# Altium schematic sheet Voltage supply of sEMG & ADC.SchDoc
size 297 x 209 mm
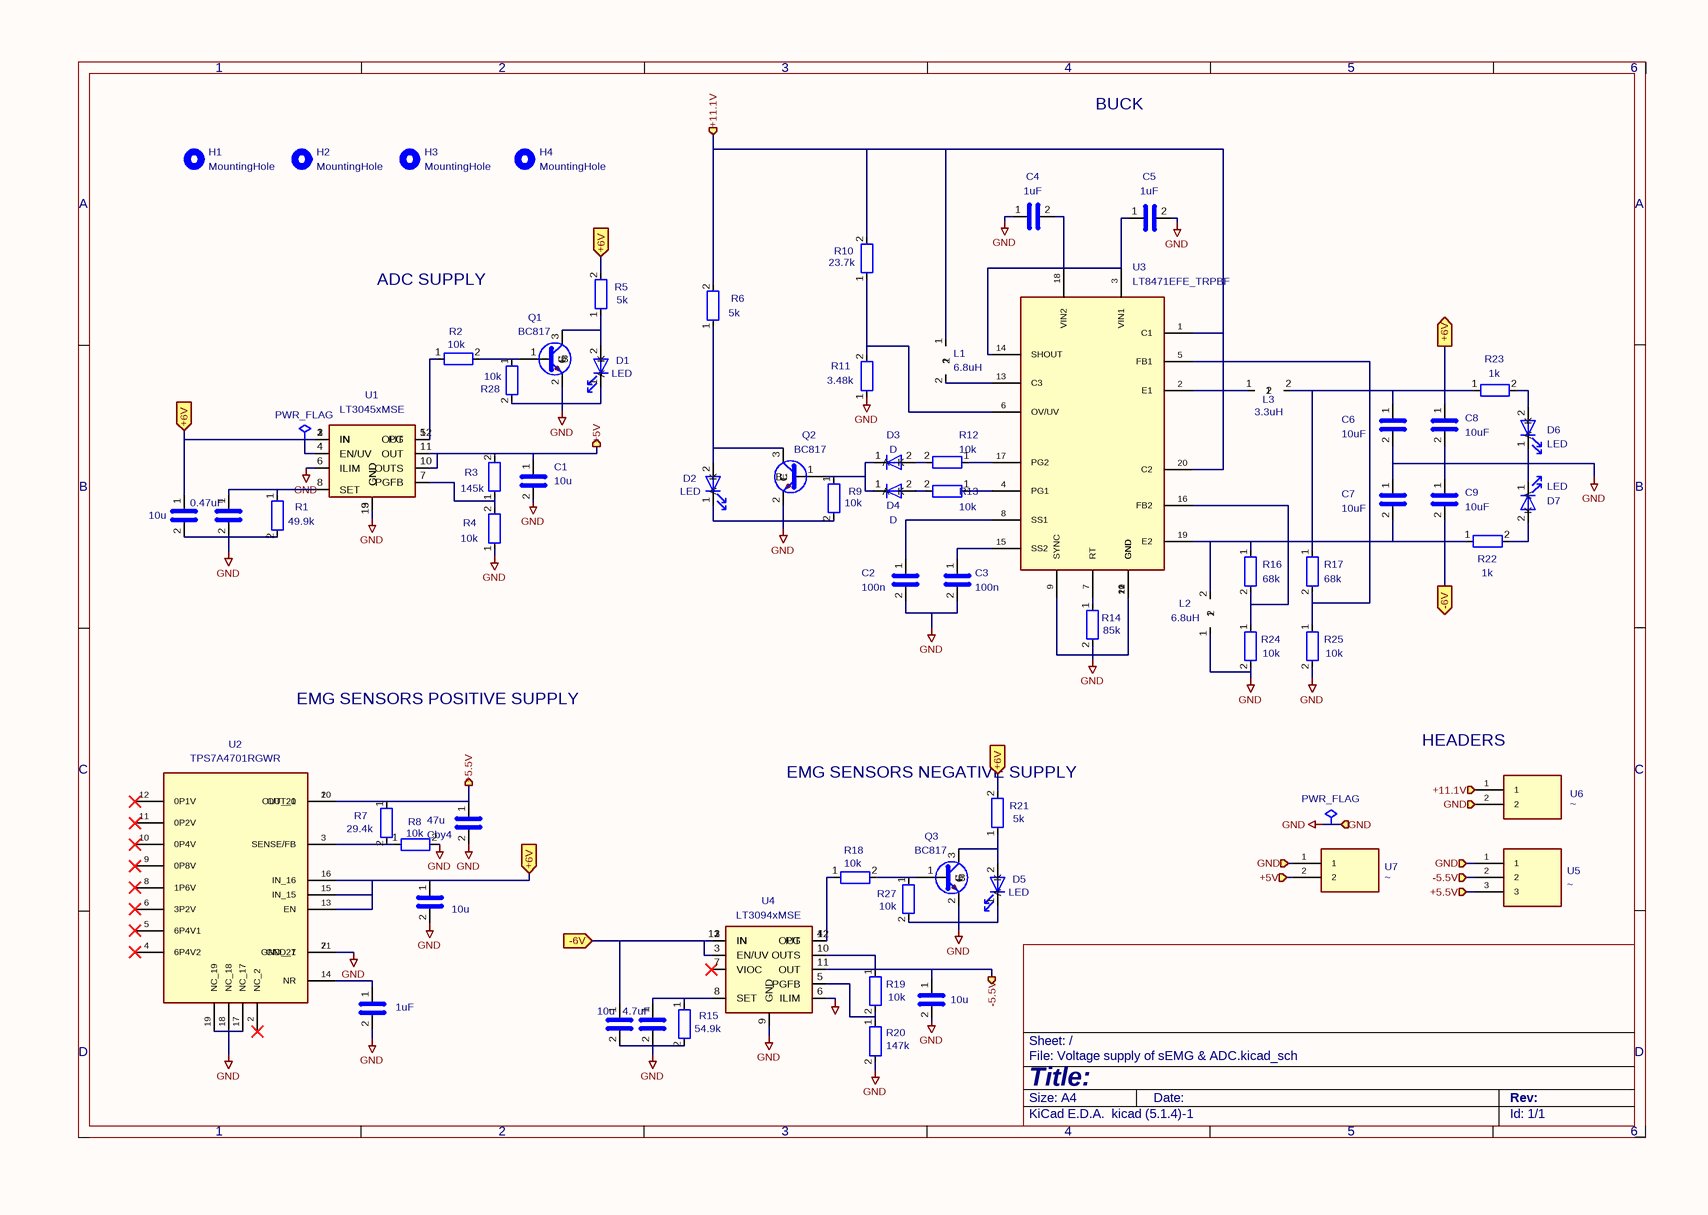
[diagram p0: Voltage supply of sEMG & ADC.SchDoc]

## Parts
#FLG01  PWR_FLAG  (graphical)
#FLG02  PWR_FLAG  (graphical)
C1  10u  [C_0805_2012Metric_Pad1.18x1.45mm_HandSolder]
C2  100n  [C_0402_1005Metric_Pad0.74x0.62mm_HandSolder]
C2in1  1uF  [C_0402_1005Metric_Pad0.74x0.62mm_HandSolder]
C3  100n  [C_0402_1005Metric_Pad0.74x0.62mm_HandSolder]
C4  1uF  [C_0603_1608Metric_Pad1.08x0.95mm_HandSolder]
C5  1uF  [C_0603_1608Metric_Pad1.08x0.95mm_HandSolder]
C6  10uF  [C_0805_2012Metric_Pad1.18x1.45mm_HandSolder]
C7  10uF  [C_0805_2012Metric_Pad1.18x1.45mm_HandSolder]
C8  10uF  [C_0805_2012Metric_Pad1.18x1.45mm_HandSolder]
C9  10uF  [C_0805_2012Metric_Pad1.18x1.45mm_HandSolder]
Cby1  10u  [C_0805_2012Metric_Pad1.18x1.45mm_HandSolder]
Cby2  0.47uF  [C_0805_2012Metric_Pad1.18x1.45mm_HandSolder]
Cby3  10u  [C_0805_2012Metric_Pad1.18x1.45mm_HandSolder]
Cby4  47u  [C_1210_3225Metric_Pad1.33x2.70mm_HandSolder]
Cby5  10u  [C_0805_2012Metric_Pad1.18x1.45mm_HandSolder]
Cby6  4.7uF  [C_0805_2012Metric_Pad1.18x1.45mm_HandSolder]
Cby7  10u  [C_0805_2012Metric_Pad1.18x1.45mm_HandSolder]
D1  LED  [LED_0603_1608Metric_Pad1.05x0.95mm_HandSolder]
D2  LED  [LED_0603_1608Metric_Pad1.05x0.95mm_HandSolder]
D3  D  [D_SOD-123]
D4  D  [D_SOD-123]
D5  LED  [LED_0603_1608Metric_Pad1.05x0.95mm_HandSolder]
D6  LED  [LED_0603_1608Metric_Pad1.05x0.95mm_HandSolder]
D7  LED  [LED_0603_1608Metric_Pad1.05x0.95mm_HandSolder]
H1  MountingHole  [MountingHole_2.7mm_M2.5_DIN965]
H2  MountingHole  [MountingHole_2.7mm_M2.5_DIN965]
H3  MountingHole  [MountingHole_2.7mm_M2.5_DIN965]
H4  MountingHole  [MountingHole_2.7mm_M2.5_DIN965]
L1  6.8uH  [L_Coilcraft_XAL7030-102]
L2  6.8uH  [L_Coilcraft_XAL7030-102]
L3  3.3uH  [L_Coilcraft_XAL5030-XXX]
Q1  BC817  [SOT-23]
Q2  BC817  [SOT-23]
Q3  BC817  [SOT-23]
R1  49.9k  [R_0603_1608Metric_Pad0.98x0.95mm_HandSolder]
R2  10k  [R_0402_1005Metric_Pad0.72x0.64mm_HandSolder]
R3  145k  [R_0603_1608Metric_Pad0.98x0.95mm_HandSolder]
R4  10k  [R_0402_1005Metric_Pad0.72x0.64mm_HandSolder]
R5  5k  [R_0603_1608Metric_Pad0.98x0.95mm_HandSolder]
R6  5k  [R_0603_1608Metric_Pad0.98x0.95mm_HandSolder]
R7  29.4k  [R_0402_1005Metric_Pad0.72x0.64mm_HandSolder]
R8  10k  [R_0402_1005Metric_Pad0.72x0.64mm_HandSolder]
R9  10k  [R_0402_1005Metric_Pad0.72x0.64mm_HandSolder]
R10  23.7k  [R_0402_1005Metric_Pad0.72x0.64mm_HandSolder]
R11  3.48k  [R_0603_1608Metric_Pad0.98x0.95mm_HandSolder]
R12  10k  [R_0402_1005Metric_Pad0.72x0.64mm_HandSolder]
R13  10k  [R_0402_1005Metric_Pad0.72x0.64mm_HandSolder]
R14  85k  [R_0603_1608Metric_Pad0.98x0.95mm_HandSolder]
R15  54.9k  [R_0603_1608Metric_Pad0.98x0.95mm_HandSolder]
R16  68k  [R_0603_1608Metric_Pad0.98x0.95mm_HandSolder]
R17  68k  [R_0603_1608Metric_Pad0.98x0.95mm_HandSolder]
R18  10k  [R_0402_1005Metric_Pad0.72x0.64mm_HandSolder]
R19  10k  [R_0402_1005Metric_Pad0.72x0.64mm_HandSolder]
R20  147k  [R_0603_1608Metric_Pad0.98x0.95mm_HandSolder]
R21  5k  [R_0603_1608Metric_Pad0.98x0.95mm_HandSolder]
R22  1k  [R_0603_1608Metric_Pad0.98x0.95mm_HandSolder]
R23  1k  [R_0603_1608Metric_Pad0.98x0.95mm_HandSolder]
R24  10k  [R_0603_1608Metric_Pad0.98x0.95mm_HandSolder]
R25  10k  [R_0603_1608Metric_Pad0.98x0.95mm_HandSolder]
R27  10k  [R_0603_1608Metric_Pad0.98x0.95mm_HandSolder]
R28  10k  [R_0603_1608Metric_Pad0.98x0.95mm_HandSolder]
U1  LT3045xMSE  [MSOP-12-1EP_3x4.039mm_P0.65mm_EP1.651x2.845mm]
U2  TPS7A4701RGWR  [QFN65P500X500X100-21N]
U3  LT8471EFE_TRPBF  [SOP65P640X120-21N]
U4  LT3094xMSE  [MSOP-12-1EP_3x4.039mm_P0.65mm_EP1.651x2.845mm]
U5  ~  [JST_GH_SM03B-GHS-TB_1x03-1MP_P1.25mm_Horizontal]
U6  ~  [JST_GH_SM02B-GHS-TB_1x02-1MP_P1.25mm_Horizontal]
U7  ~  [JST_GH_SM02B-GHS-TB_1x02-1MP_P1.25mm_Horizontal]

## Ports
+5.5V (in), +5.5V (out), +5V (in), +5V (out), +6V (in), +6V (out), +11.1V (in), +11.1V (out), -5.5V (in), -5.5V (out), -6V (in), -6V (out), GND (in), GND (out)

## Nets
GND: #FLG01.1 C1.2 C2.2 C2in1.2 C3.2 C4.1 C5.2 C6.2 C7.1 C8.2 C9.1 Cby1.2 Cby2.2 Cby3.2 Cby4.2 Cby5.2 Cby6.2 Cby7.2 D1.1(K) D2.1(K) D5.1(K) D6.1(K) D7.1(K) L2.1 Q1.2(E) Q2.2(E) Q3.2(E) R1.2 R4.1 R8.2 R9.2 R11.1 R14.2 R15.2 R20.2 R24.2 R25.2 R27.2 R28.2 U1.6(ILIM) U1.9(GND) U1.13(GND) U2.7(GND_7) U2.17(NC_17) U2.18(NC_18) U2.19(NC_19) U2.21(GND_21) U3.9(SYNC) U3.10(GND) U3.11(GND) U3.12(GND) U3.21(GND) U4.6(ILIM) U4.9(GND) U5.1 U6.2 U7.1 ; port GND
+5.5V: Cby4.1 R7.1 U2.1(OUT_1) U2.20(OUT_20) U5.3 ; port +5.5V
+5V: C1.1 R3.2 U1.10(OUTS) U1.11(OUT) U7.2 ; port +5V
+6V: #FLG02.1 C6.1 C8.1 Cby1.1 Cby3.1 L3.2 R5.2 R17.1 R21.2 R23.1 U1.1(IN) U1.2(IN) U1.3(IN) U1.4(EN/UV) U2.13(EN) U2.15(IN_15) U2.16(IN_16) ; port +6V
+11.1V: L1.1 R6.2 R10.2 U3.1(C1) U3.20(C2) U6.1 ; port +11.1V
-5.5V: Cby7.1 R19.1 U4.10(OUTS) U4.11(OUT) U5.2 ; port -5.5V
-6V: C7.2 C9.2 Cby5.1 L2.2 R16.1 R22.1 U3.19(E2) U4.1(IN) U4.2(IN) U4.3(EN/UV) U4.13(IN) ; port -6V
NetC2_1: C2.1 U3.8(SS1)
NetC2in1_1: C2in1.1 U2.14(NR)
NetC3_1: C3.1 U3.15(SS2)
NetC4_2: C4.2 C5.1 U3.3(VIN1) U3.14(SHOUT) U3.18(VIN2)
NetCby2_1: Cby2.1 R1.1 U1.8(SET)
NetCby6_1: Cby6.1 R15.1 U4.8(SET)
NetD1_2: D1.2(A) Q1.3(C) R5.1
NetD2_2: D2.2(A) Q2.3(C) R6.1
NetD3_1: D3.1(K) D4.1(K) Q2.1(B) R9.1
NetD3_2: D3.2(A) R12.2
NetD4_2: D4.2(A) R13.2
NetD5_2: D5.2(A) Q3.3(C) R21.1
NetD6_2: D6.2(A) R23.2
NetD7_2: D7.2(A) R22.2
NetL1_2: L1.2 U3.13(C3)
NetL3_1: L3.1 U3.2(E1)
NetQ1_1: Q1.1(B) R2.2 R28.1
NetQ3_1: Q3.1(B) R18.2 R27.1
NetR2_1: R2.1 U1.5(PG) U1.12(OUT)
NetR3_1: R3.1 R4.2 U1.7(PGFB)
NetR7_2: R7.2 R8.1 U2.3(SENSE/FB)
NetR10_1: R10.1 R11.2 U3.6(OV/UV)
NetR12_1: R12.1 U3.17(PG2)
NetR13_1: R13.1 U3.4(PG1)
NetR14_1: R14.1 U3.7(RT)
NetR16_2: R16.2 R24.1 U3.16(FB2)
NetR17_2: R17.2 R25.1 U3.5(FB1)
NetR18_1: R18.1 U4.4(PG) U4.12(OUT)
NetR19_2: R19.2 R20.1 U4.5(PGFB)

Not connected (* = marked no-connect by the designer): U2 2(NC_2)* 4(6P4V2)* 5(6P4V1)* 6(3P2V)* 8(1P6V)* 9(0P8V)* 10(0P4V)* 11(0P2V)* 12(0P1V)*; U4 7(VIOC)*

## Notes on the sheet
- BUCK
- ADC SUPPLY
- EMG SENSORS POSITIVE SUPPLY
- (near R21) EMG SENSORS NEGATIVE SUPPLY
- (near U6) HEADERS
- 1
- 2
- 3
- 4
- 5
- 6
- A
- B
- C
- D
- Title:
- File: Voltage supply of sEMG & ADC.kicad_sch
- Sheet: /
- KiCad E.D.A.  kicad (5.1.4)-1
- Size: A4
- Date:
- Rev:
- Id: 1/1

## Library data of the parts
#FLG01 #FLG02 = PWR_FLAG: Description: Special symbol for telling ERC where power comes from; Value: PWR_FLAG
C1 C2 C2in1 C3-C9 Cby1-Cby7 = C: Description: Unpolarized capacitor
  C1 Cby1 Cby3 Cby5 Cby7: Value: 10u; Footprint: Capacitor_SMD:C_0805_2012Metric_Pad1.18x1.45mm_HandSolder
  C2 C3: Value: 100n; Footprint: Capacitor_SMD:C_0402_1005Metric_Pad0.74x0.62mm_HandSolder
  C2in1: Value: 1uF; Footprint: Capacitor_SMD:C_0402_1005Metric_Pad0.74x0.62mm_HandSolder
  C4 C5: Value: 1uF; Footprint: Capacitor_SMD:C_0603_1608Metric_Pad1.08x0.95mm_HandSolder
  C6-C9: Value: 10uF; Footprint: Capacitor_SMD:C_0805_2012Metric_Pad1.18x1.45mm_HandSolder
  Cby2: Value: 0.47uF; Footprint: Capacitor_SMD:C_0805_2012Metric_Pad1.18x1.45mm_HandSolder
  Cby4: Value: 47u; Footprint: Capacitor_SMD:C_1210_3225Metric_Pad1.33x2.70mm_HandSolder
  Cby6: Value: 4.7uF; Footprint: Capacitor_SMD:C_0805_2012Metric_Pad1.18x1.45mm_HandSolder
D1 D2 D5-D7 = LED: Description: Light emitting diode; Value: LED; Footprint: LED_SMD:LED_0603_1608Metric_Pad1.05x0.95mm_HandSolder
D3 D4 = D: Description: Diode; Sim.Pins: 1=K 2=A; Sim.Device: D; Value: D; Footprint: Diode_SMD:D_SOD-123
H1-H4 = MountingHole: Description: Mounting Hole without connection; Value: MountingHole; Footprint: MountingHole:MountingHole_2.7mm_M2.5_DIN965
L1-L3 = L: Description: Inductor
  L1: Website: https://www.digikey.com/en/products/detail/coilcraft/LPS4018-682MRC/12714582; Value: 6.8uH; Footprint: Inductor_SMD:L_Coilcraft_XAL7030-102
  L2: Website: https://www.digikey.com/en/products/detail/w%C3%BCrth-elektronik/74437324068/2791049; Value: 6.8uH; Footprint: Inductor_SMD:L_Coilcraft_XAL7030-102
  L3: Website: https://www.digikey.com/en/products/detail/w%C3%BCrth-elektronik/74437324033/2791046; Value: 3.3uH; Footprint: Inductor_SMD:L_Coilcraft_XAL5030-XXX
Q1-Q3 = BC817: Description: 0.8A Ic, 45V Vce, NPN Transistor, SOT-23; Value: BC817; Footprint: Package_TO_SOT_SMD:SOT-23
R1-R25 R27 R28 = R: Description: Resistor
  R1: Value: 49.9k; Footprint: Resistor_SMD:R_0603_1608Metric_Pad0.98x0.95mm_HandSolder
  R2 R4 R8 R9 R12 R13 R18 R19: Value: 10k; Footprint: Resistor_SMD:R_0402_1005Metric_Pad0.72x0.64mm_HandSolder
  R3: Value: 145k; Footprint: Resistor_SMD:R_0603_1608Metric_Pad0.98x0.95mm_HandSolder
  R5 R6 R21: Value: 5k; Footprint: Resistor_SMD:R_0603_1608Metric_Pad0.98x0.95mm_HandSolder
  R7: Value: 29.4k; Footprint: Resistor_SMD:R_0402_1005Metric_Pad0.72x0.64mm_HandSolder
  R10: Website: https://www.digikey.be/en/products/detail/stackpole-electronics-inc/RMCF0402FT23K7/1714563; Value: 23.7k; Footprint: Resistor_SMD:R_0402_1005Metric_Pad0.72x0.64mm_HandSolder
  R11: Website: https://www.digikey.in/en/products/detail/yageo/RC0402FR-073K48L/5281008; Value: 3.48k; Footprint: Resistor_SMD:R_0603_1608Metric_Pad0.98x0.95mm_HandSolder
  R14: Value: 85k; Footprint: Resistor_SMD:R_0603_1608Metric_Pad0.98x0.95mm_HandSolder
  R15: Value: 54.9k; Footprint: Resistor_SMD:R_0603_1608Metric_Pad0.98x0.95mm_HandSolder
  R16 R17: Website: https://www.digikey.com/en/products/detail/susumu/RG1608P-683-B-T5/1228890; Value: 68k; Footprint: Resistor_SMD:R_0603_1608Metric_Pad0.98x0.95mm_HandSolder
  R20: Value: 147k; Footprint: Resistor_SMD:R_0603_1608Metric_Pad0.98x0.95mm_HandSolder
  R22 R23: Value: 1k; Footprint: Resistor_SMD:R_0603_1608Metric_Pad0.98x0.95mm_HandSolder
  R24 R25 R27 R28: Website: https://www.digikey.lv/en/products/detail/panasonic-electronic-components/ERA-3AEB103V/1465878; Value: 10k; Footprint: Resistor_SMD:R_0603_1608Metric_Pad0.98x0.95mm_HandSolder
U1 = LT3045xMSE: Description: 500mA, Adjustable, Ultralow Noise, Ultrahigh PSRR Linear Regulator, MSOP-12; Value: LT3045xMSE; Footprint: Package_SO:MSOP-12-1EP_3x4.039mm_P0.65mm_EP1.651x2.845mm
U3 = LT8471EFE_TRPBF: MF: Analog Devices; MP: LT8471EFE#TRPBF; Description_1: \n                        \n                            Dual Multitopology DC/DC Converters with 2A Switches and Synchronization\n                        \n; MAXIMUM_PACKAGE_HEIGHT: 1.2 mm; Package: TSSOP -20 Analog Devices; Price: None; Check_prices: https://www.snapeda.com/parts/LT8471EFE%23TRPBF/Analog+Devices/view-part/?ref=eda; STANDARD: IPC-7351B; PARTREV: D; SnapEDA_Link: https://www.snapeda.com/parts/LT8471EFE%23TRPBF/Analog+Devices/view-part/?ref=snap; Availability: In Stock; MANUFACTURER: Analog Devices; Value: LT8471EFE_TRPBF; Footprint: BUCK:SOP65P640X120-21N
U4 = LT3094xMSE: Description: -500mA, Adjustable, Ultralow Noise, Ultrahigh PSRR RF Negative Linear Regulator, MSOP-12; Value: LT3094xMSE; Footprint: Package_SO:MSOP-12-1EP_3x4.039mm_P0.65mm_EP1.651x2.845mm
U5 = H_3: Value: ~; Footprint: Connector_JST:JST_GH_SM03B-GHS-TB_1x03-1MP_P1.25mm_Horizontal
U6 U7 = H_2: Value: ~; Footprint: Connector_JST:JST_GH_SM02B-GHS-TB_1x02-1MP_P1.25mm_Horizontal
U2 = TPS7A4701RGWR: Value: TPS7A4701RGWR; Footprint: BUCK:QFN65P500X500X100-21N